# Altium schematic sheet Potentiometer.SchDoc
size Letter
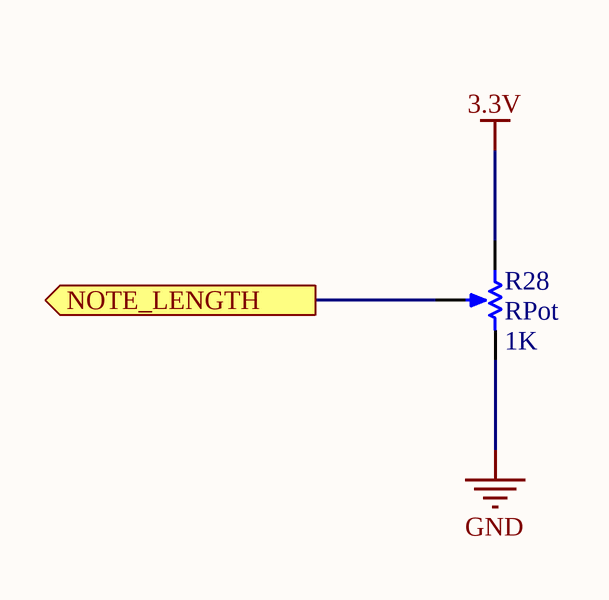
[diagram p0: Potentiometer.SchDoc]

## Parts
R28  RPot  value 1K  [VR5]

## Ports
NOTE_LENGTH (out)

## Nets
3.3V: R28.1(TOP)
GND: R28.2(BOT)
NOTE_LENGTH: R28.3(TAP) ; port NOTE_LENGTH

## Library data of the parts
R28 = RPot: Potentiometer; Sim Note: Enter the Resistance value and the set point into parameter fields.; Set Position: 0.5; Published: 8-Jun-2000; LatestRevisionDate: 17-Jul-2002; LatestRevisionNote: Re-released for DXP Platform.; PackageReference: VR5; Publisher: Altium Limited; PackageDescription: Variable Resistor, Thru-Hole; 3 Leads